# EAGLE design Gatekeeper v0.1 (EAGLE 7.1.0)
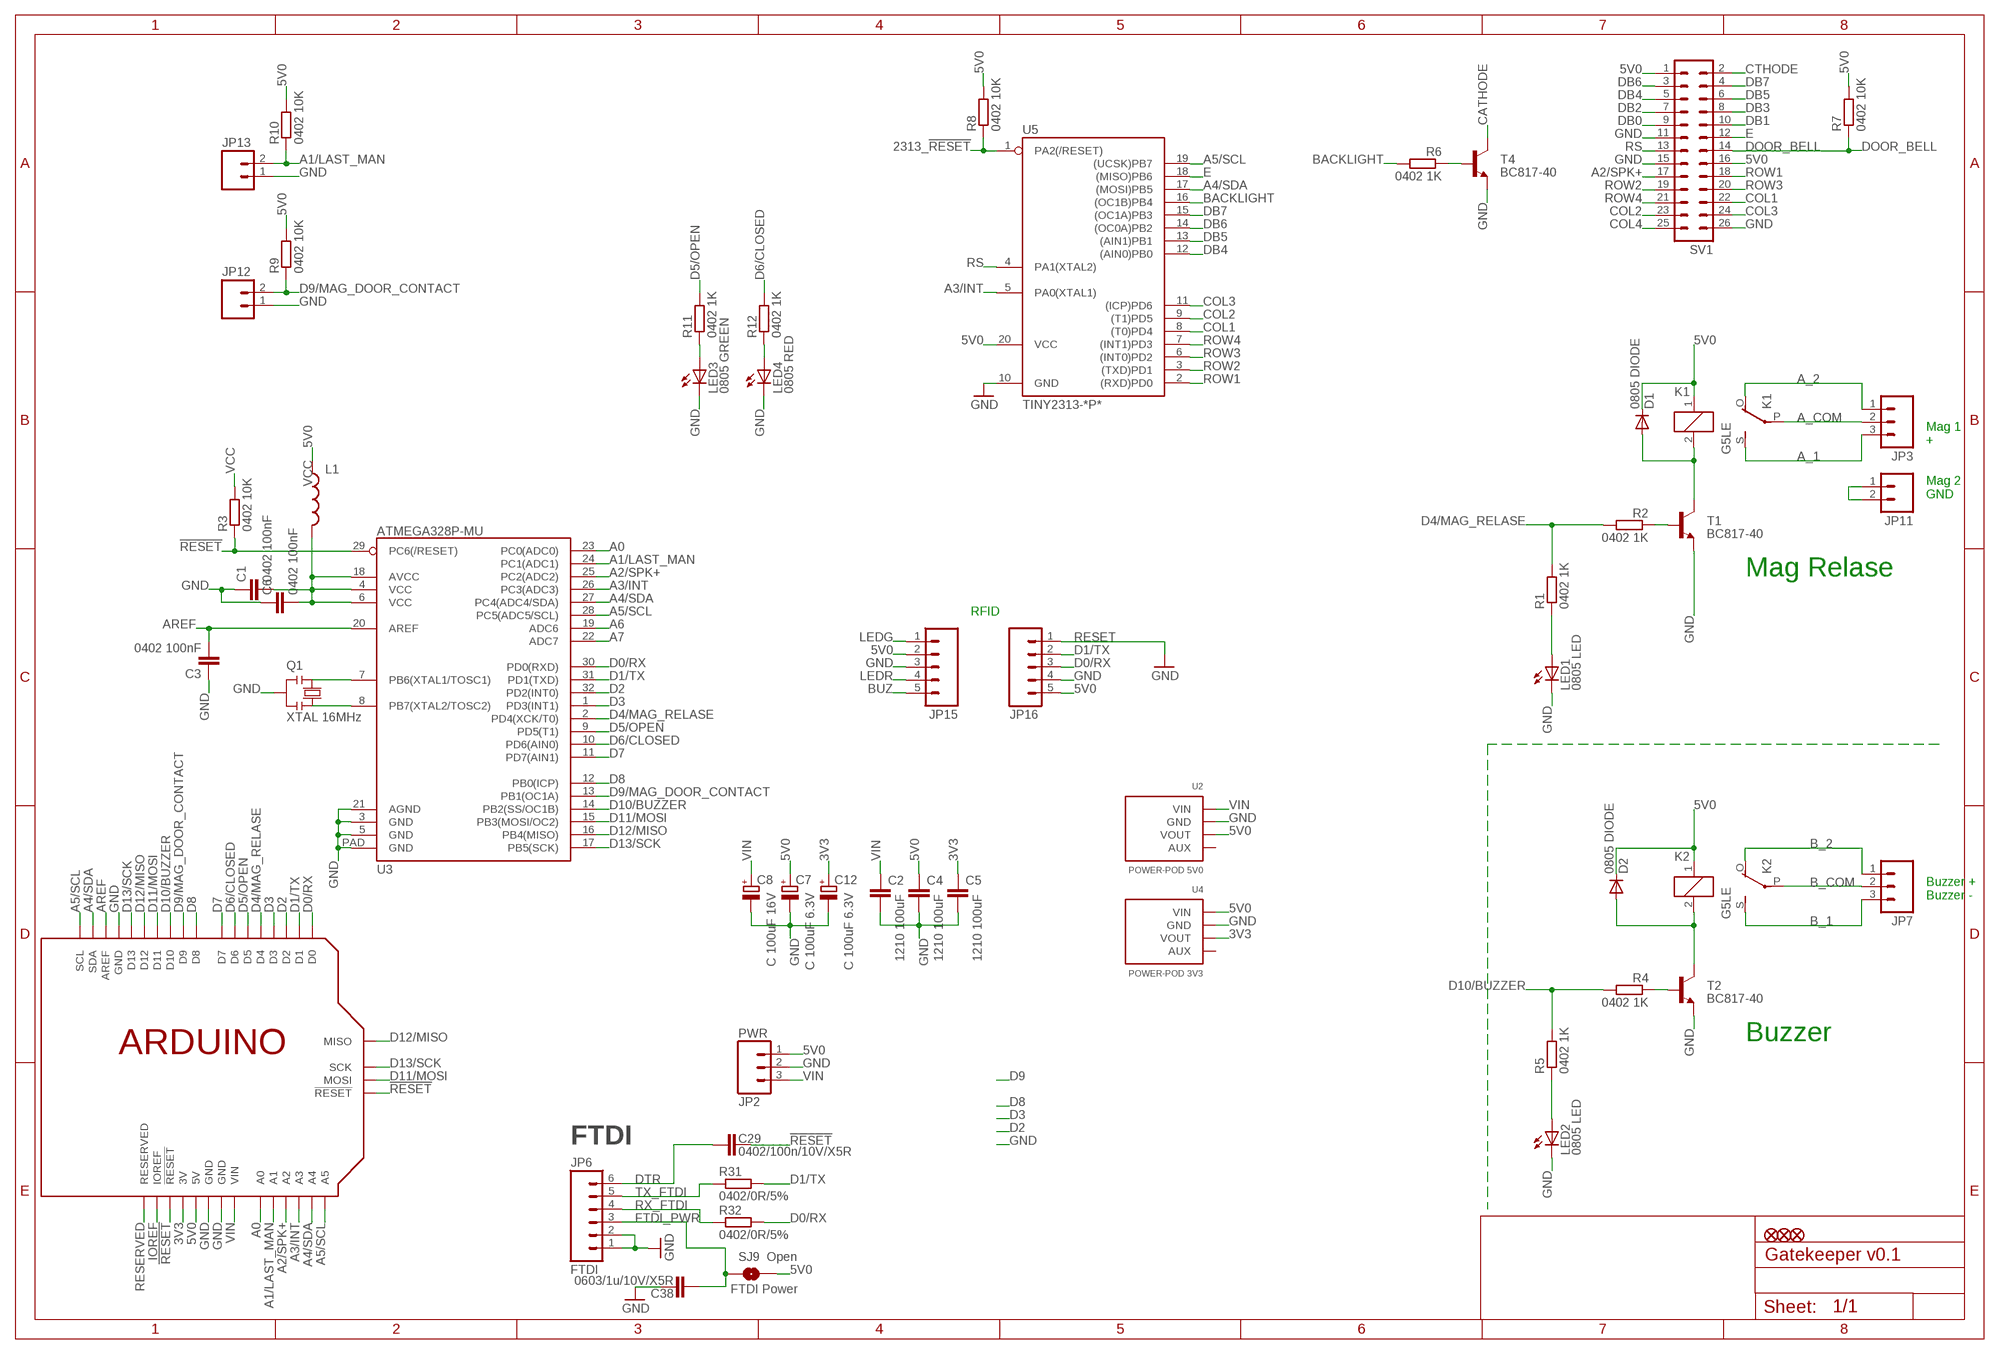
[diagram p0: schematic, sheet 1]

## Parts
C1  0402 100nF  C-EUC0402-SMALLER  [C0402-SMALLER]
C2  1210 100uF  C-EUC1210  [C1210]
C3  0402 100nF  C-EUC0402-SMALLER  [C0402-SMALLER]
C4  1210 100uF  C-EUC1210  [C1210]
C5  1210 100uF  C-EUC1210  [C1210]
C6  0402 100nF  C-EUC0402-SMALLER  [C0402-SMALLER]
C7  C 100uF 6.3V  CPOL-EUC  [PANASONIC_C]
C8  C 100uF 16V  CPOL-EUC  [PANASONIC_C]
C12  C 100uF 6.3V  CPOL-EUC  [PANASONIC_C]
C29  0402/100n/10V/X5R  C-EUC0402-ARDUINO-ROUND  [C0402-ARDUINO-ROUND]
C38  0603/1u/10V/X5R  C-EUC0603-ROUND  [C0603-ROUND]
D1  0805 DIODE  DIODE-0805  [0805-DIODE]
D2  0805 DIODE  DIODE-0805  [0805-DIODE]
JP2  PWR  M03-SCREW-5MM  [SCREWTERMINAL-5MM-3]
JP3  M03-SCREW-5MM  [SCREWTERMINAL-5MM-3]
JP6  FTDI  M06SIP  [1X06]
JP7  M03-SCREW-5MM  [SCREWTERMINAL-5MM-3]
JP8  FIDUCIAL1X2.5-STOP  [FIDUCIAL-1X2.5-STOP]
JP9  FIDUCIAL1X2.5-STOP  [FIDUCIAL-1X2.5-STOP]
JP10  FIDUCIAL1X2.5-STOP  [FIDUCIAL-1X2.5-STOP]
JP11  M025MM  [SCREWTERMINAL-5MM-2]
JP12  M025MM  [SCREWTERMINAL-5MM-2]
JP13  M025MM  [SCREWTERMINAL-5MM-2]
JP15  M05PTH  [1X05]
JP16  M05PTH  [1X05]
K1  G5LE  [G5LE]
K2  G5LE  [G5LE]
L1  INDUCTOR0603K-SMALL  [C0603K-SMALL]
LED1  0805 LED  LED0805-1206  [LED-0805-1206]
LED2  0805 LED  LED0805-1206  [LED-0805-1206]
LED3  0805 GREEN  LED0805-1206  [LED-0805-1206]
LED4  0805 RED  LED0805-1206  [LED-0805-1206]
Q1  XTAL 16MHz  RESONATORMU  [RESONATOR]
R1  0402 1K  R-EU_R0402-SMALLER  [R0402-SMALLER]
R2  0402 1K  R-EU_R0402-SMALLER  [R0402-SMALLER]
R3  0402 10K  R-EU_R0402-SMALLER  [R0402-SMALLER]
R4  0402 1K  R-EU_R0402-SMALLER  [R0402-SMALLER]
R5  0402 1K  R-EU_R0402-SMALLER  [R0402-SMALLER]
R6  0402 1K  R-EU_R0402-SMALLER  [R0402-SMALLER]
R7  0402 10K  R-EU_R0402-SMALLER  [R0402-SMALLER]
R8  0402 10K  R-EU_R0402-SMALLER  [R0402-SMALLER]
R9  0402 10K  R-EU_R0402-SMALLER  [R0402-SMALLER]
R10  0402 10K  R-EU_R0402-SMALLER  [R0402-SMALLER]
R11  0402 1K  R-EU_R0402-SMALLER  [R0402-SMALLER]
R12  0402 1K  R-EU_R0402-SMALLER  [R0402-SMALLER]
R31  0402/0R/5%  R-EU_R0402-ARDUINO-ROUND  [R0402-ARDUINO-ROUND]
R32  0402/0R/5%  R-EU_R0402-ARDUINO-ROUND  [R0402-ARDUINO-ROUND]
SJ9  FTDI Power  SOLDERJUMPERNO  [SJ_2S-NO]
SV1  MA13-2  [MA13-2]
T1  BC817-40  BC817-NPN-SOT23-BEC  [SOT23-BEC]
T2  BC817-40  BC817-NPN-SOT23-BEC  [SOT23-BEC]
T4  BC817-40  BC817-NPN-SOT23-BEC  [SOT23-BEC]
U1  ARDUINOSPI-REFRENCE  [ARDUINOR3-LWKTXT-REF-SPI]
U2  POWER-POD 5V0  POWER-POD  [POWER-POD-LANDING]
U3  ATMEGA328P-MU  ATMEGA328-MLF-SHORT  [MLF32-SHORT-CREAM]
U4  POWER-POD 3V3  POWER-POD  [POWER-POD-LANDING]
U5  TINY2313-*P*  [DIL20]

## Nets
3V3: C5.1 C12.+ U1.3V U4.3(VOUT)
5V0: C4.1 C7.+ D1.C D2.C JP2.1 JP15.2 JP16.5 K1.1 K2.1 L1.1 R7.2 R8.2 R9.2 R10.2 SJ9.2 SV1.1 SV1.16 U1.5V U1.5V@ISP(5V) U2.3(VOUT) U4.1(VIN) U5.20(VCC)
2313_!RESET: R8.1 U5.1(PA2(/RESET))
!RESET: C29.1 R3.1 U1.!RESET U1.!RESET@ISP(!RESET) U3.29(PC6(/RESET))
A0: U1.A0 U3.23(PC0(ADC0))
A1/LAST_MAN: JP13.2 R10.1 U1.A1 U3.24(PC1(ADC1))
A2/SPK+: SV1.17 U1.A2 U3.25(PC2(ADC2))
A3/INT: U1.A3 U3.26(PC3(ADC3)) U5.5(PA0(XTAL1))
A4/SDA: U1.A4 U1.SDA U3.27(PC4(ADC4/SDA)) U5.17((MOSI)PB5)
A5/SCL: U1.A5 U1.SCL U3.28(PC5(ADC5/SCL)) U5.19((UCSK)PB7)
A6: U3.19(ADC6)
A7: U3.22(ADC7)
A_1 [MAINS]: JP3.3 K1.S(2:S)
A_2 [MAINS]: JP3.1 K1.O(2:O)
A_COM [MAINS]: JP3.2 K1.P(2:P)
AREF: C3.2 U1.AREF U3.20(AREF)
B_1 [MAINS]: JP7.3 K2.S(2:S)
B_2 [MAINS]: JP7.1 K2.O(2:O)
B_COM [MAINS]: JP7.2 K2.P(2:P)
BACKLIGHT: R6.2 U5.16((OC1B)PB4)
BUZ: JP15.5
CATHODE: T4.C
COL1: SV1.22 U5.8((T0)PD4)
COL2: SV1.23 U5.9((T1)PD5)
COL3: SV1.24 U5.11((ICP)PD6)
COL4: SV1.25
CTHODE: SV1.2
D0/RX: JP16.3 R32.2 U1.D0 U3.30(PD0(RXD))
D1/TX: JP16.2 R31.2 U1.D1 U3.31(PD1(TXD))
D2: U1.D2 U3.32(PD2(INT0))
D3: U1.D3 U3.1(PD3(INT1))
D4/MAG_RELASE: R1.2 R2.2 U1.D4 U3.2(PD4(XCK/T0))
D5/OPEN: R11.2 U1.D5 U3.9(PD5(T1))
D6/CLOSED: R12.2 U1.D6 U3.10(PD6(AIN0))
D7: U1.D7 U3.11(PD7(AIN1))
D8: U1.D8 U3.12(PB0(ICP))
D9/MAG_DOOR_CONTACT: JP12.2 R9.1 U1.D9 U3.13(PB1(OC1A))
D10/BUZZER: R4.2 R5.2 U1.D10 U3.14(PB2(SS/OC1B))
D11/MOSI: U1.D11 U1.MOSI U3.15(PB3(MOSI/OC2))
D12/MISO: U1.D12 U1.MISO U3.16(PB4(MISO))
D13/SCK: U1.D13 U1.SCK U3.17(PB5(SCK))
DB0: SV1.9
DB1: SV1.10
DB2: SV1.7
DB3: SV1.8
DB4: SV1.5 U5.12((AIN0)PB0)
DB5: SV1.6 U5.13((AIN1)PB1)
DB6: SV1.3 U5.14((OC0A)PB2)
DB7: SV1.4 U5.15((OC1A)PB3)
DOOR_BELL: R7.1 SV1.14
DTR: C29.2 JP6.6
E: SV1.12 U5.18((MISO)PB6)
FTDI_PWR: C38.2 JP6.3 SJ9.1
GND: C1.1 C2.2 C3.1 C4.2 C5.2 C6.1 C7.- C8.- C12.- C38.1 JP2.2 JP6.1 JP6.2 JP12.1 JP13.1 JP15.3 JP16.4 LED1.C LED2.C LED3.C LED4.C Q1.2 SV1.11 SV1.15 SV1.26 T1.E T2.E T4.E U1.GND@1(GND) U1.GND@2(GND) U1.GND@3(GND) U1.GND@ISP(GND) U2.2(GND) U3.3(GND) U3.5(GND) U3.21(AGND) U3.PAD(GND) U4.2(GND) U5.10(GND)
IOREF: U1.IOREF
LED2_RELAY: LED1.A R1.1
LED_RELAYB: LED2.A R5.1
LEDG: JP15.1
LEDR: JP15.4
N$1: R4.1 T2.B
N$3: Q1.1 U3.7(PB6(XTAL1/TOSC1))
N$4: Q1.3 U3.8(PB7(XTAL2/TOSC2))
N$5: JP11.1 JP11.2
N$6: R2.1 T1.B
N$7: R6.1 T4.B
N$11: LED3.A R11.1
N$12: LED4.A R12.1
RESERVED: U1.RESERVED
RESET: JP16.1 ; supply symbol labelled GND
ROW1: SV1.18 U5.2((RXD)PD0)
ROW2: SV1.19 U5.3((TXD)PD1)
ROW3: SV1.20 U5.6((INT0)PD2)
ROW4: SV1.21 U5.7((INT1)PD3)
RS: SV1.13 U5.4(PA1(XTAL2))
RX_FTDI: JP6.4 R32.1
TO-TR: D1.A K1.2 T1.C
TO-TR1: D2.A K2.2 T2.C
TX_FTDI: JP6.5 R31.1
VCC: C1.2 C6.2 L1.2 R3.2 U3.4(VCC) U3.6(VCC) U3.18(AVCC)
VIN: C2.1 C8.+ JP2.3 U1.VIN U2.1(VIN)
Unconnected: U2.4(AUX) U4.4(AUX)

## Notes on the sheet
- Mag 1
  +
  
  
  Mag 2
  GND
- Mag Relase
- RFID
- Buzzer +
  Buzzer -
- Buzzer
- FTDI
- Open

## Library data of the parts
C1-C6 = CISECO eaglecad designs:C-EU: CAPACITOR, European symbol
C7 C8 C12 = rcl:CPOL-EU: POLARIZED CAPACITOR, European symbol
C29 C38 = TiLDA Mk2 Parts:C-EU: CAPACITOR, European symbol
D1 D2 = CISECO eaglecad designs:DIODE-: DIODE
JP2 JP3 JP7 = CISECO eaglecad designs:M03: Header 3 Standard 3-pin 0.1" header. Use with straight break away headers (SKU : PRT-00116), right angle break away headers (PRT-00553), swiss pins (PRT-00743), machine pins (PRT-00117), and female headers (PRT-00115). Molex polarized connector foot print use with SKU : PRT-08232 with associated crimp pins and housings.
JP6 = TiLDA Mk2 Parts:M06: Header 6 Standard 6-pin 0.1" header. Use with straight break away headers (SKU : PRT-00116), right angle break away headers (PRT-00553), swiss pins (PRT-00743), machine pins (PRT-00117), and female headers (PRT-00115). Molex polarized connector foot print use with SKU : PRT-08094 with associated crimp pins and housings. NOTES ON THE VARIANTS LOCK and LOCK_LONGPADS... This footprint was designed to help hold the alignment of a through-hole component (i.e. 6-pin header) while soldering it into place. You may notice that each hole has been shifted either up or down by 0.005 of an inch from it's more standard position (which is a perfectly straight line). This slight alteration caused the pins (the squares in the middle) to touch the edges of the holes. Because they are alternating, it causes a "brace" to hold the component in place. 0.005 has proven to be the perfect amount of "off-center" position when using our standard breakaway headers. Although looks a little odd when you look at the bare footprint, once you have a header in there, the alteration is very hard to notice. Also, if you push a header all the way into place, it is covered up entirely on the bottom side. This idea of altering the position of holes to aid alignment will be further integrated into the Sparkfun Library for other footprints. It can help hold any component with 3 or more connection pins.
JP8-JP10 = CISECO eaglecad designs:FIDUCIAL: Fiducial Alignment Points Various fiducial points for machine vision alignment.
JP11-JP13 = CISECO eaglecad designs:M02: Header 2 Standard 2-pin 0.1" header. Use with straight break away headers (SKU : PRT-00116), right angle break away headers (PRT-00553), swiss pins (PRT-00743), machine pins (PRT-00117), and female headers (PRT-00115). Molex polarized connector foot print use with SKU : PRT-08233 with associated crimp pins and housings.
JP15 JP16 = SparkFun:M05: Header 5 Standard 5-pin 0.1" header. Use with straight break away headers (SKU : PRT-00116), right angle break away headers (PRT-00553), swiss pins (PRT-00743), machine pins (PRT-00117), and female headers (PRT-00115). Molex polarized connector foot print use with SKU : PRT-08230 with associated crimp pins and housings.
K1 K2 = relay:G5LE: RELAY 1 x switch, 10 A/120 V AC, 8 A/30 V DC, Omron; OC_FARNELL: unknown; OC_NEWARK: unknown
L1 = CISECO eaglecad designs:INDUCTOR: Inductors Basic Inductor/Choke - 0603 and 1206. Footprints are not proven and vary greatly between part numbers.
LED1-LED4 = CISECO eaglecad designs:LED: LEDs Standard schematic elements and footprints for 5mm, 3mm, 1206, and 0603 sized LEDs. 5mm - Spark Fun Electronics SKU : COM-00529 (and others)
Q1 = MySMD2:RESONATOR
R1-R12 = CISECO eaglecad designs:R-EU_: RESISTOR, European symbol
R31 R32 = TiLDA Mk2 Parts:R-EU_: RESISTOR, European symbol
SJ9 = TiLDA Mk2 Parts:SOLDERJUMPER: Solder Jumper Standard SMD solder jumper. Used to automate production. Two varients : Normally Open and Normally Closed are the same, but have different paste layers. NC will have a large amount of paste and should jumper during reflow.
SV1 = CISECO eaglecad designs:MA13-2: PIN HEADER; OC_FARNELL: unknown; OC_NEWARK: unknown
T1 T2 T4 = transistor:*-NPN-: NPN Transistror BF959 corrected 2008.03.06
U1 = CISECO eaglecad designs:ARDUINOSPI
U2 U4 = Ciseco Footprints:POWER-POD
U3 = CISECO eaglecad designs:ATMEGA328-MLF
U5 = avr-6:TINY2313*: Atmel Tiny2313 2K Flash, 128 bytes EEPROM, 128 bytes RAM

## Net classes
2 MAINS: clearance 2 mm

## Board
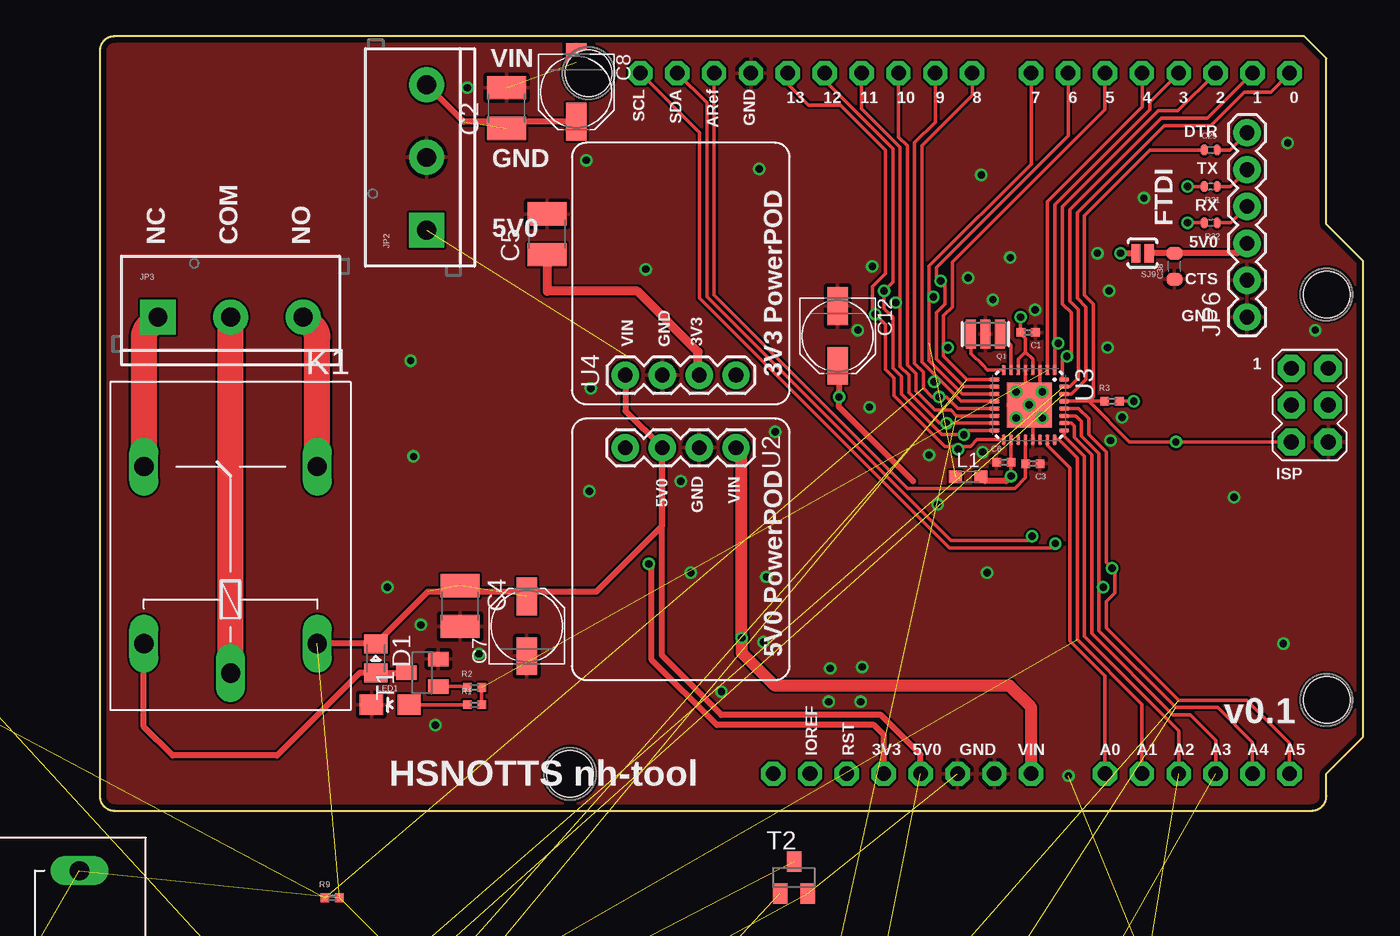
[diagram p1: board, top side]
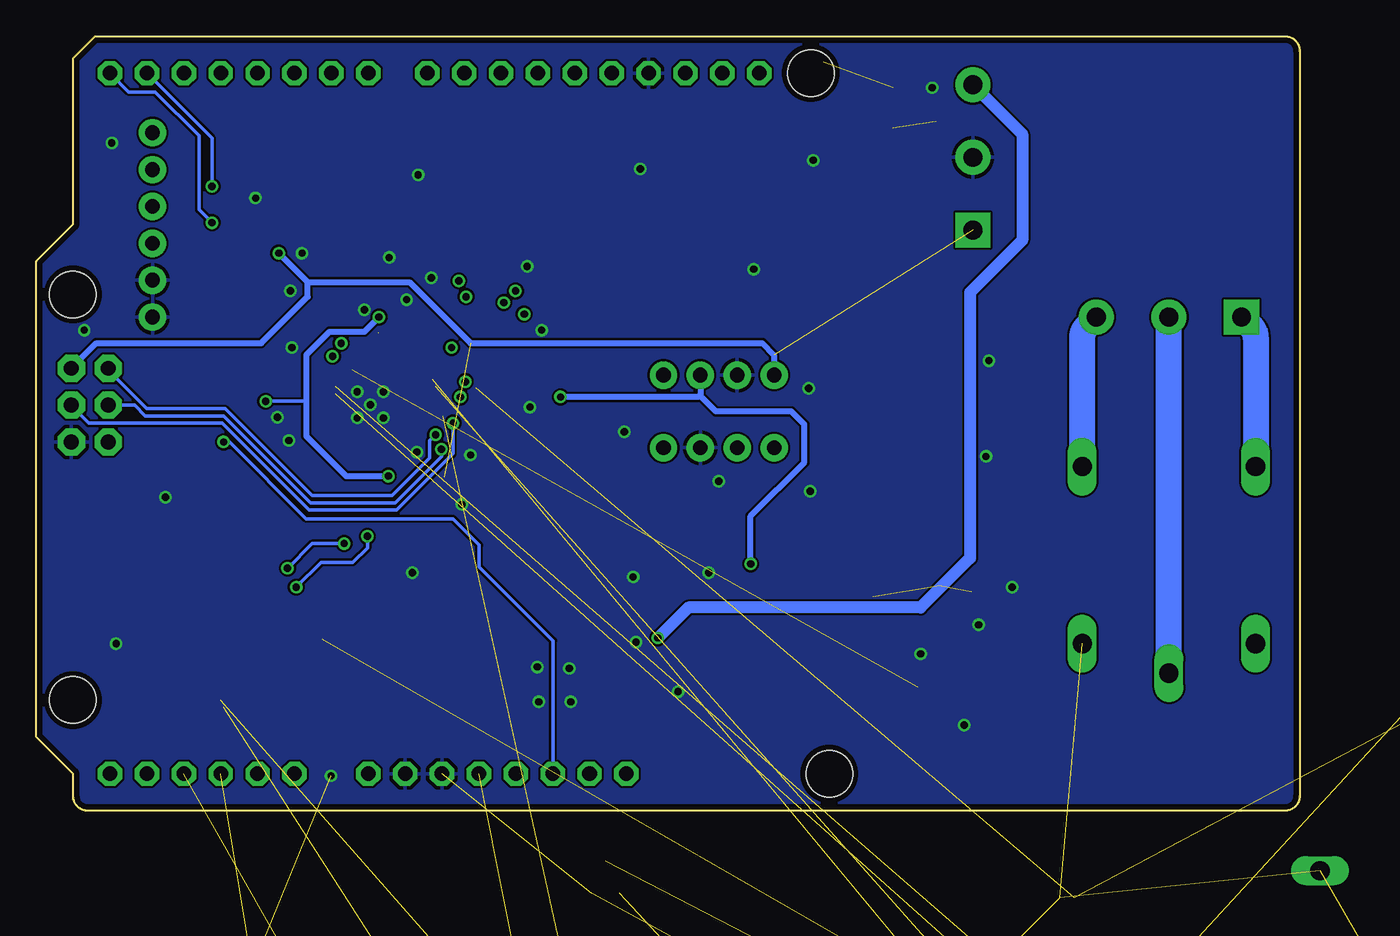
[diagram p2: board, bottom side, seen from below]

Size 87 x 53.34 mm. Coordinates in mm from the lower left corner, seen from the top.
Outline: 0,52.34 0,1 arc90 1,0 83.46,0 arc90 84.46,1 84.46,2.54 87,5.08 87,37.85 84.46,40.39 84.46,51.82 82.94,53.34 1,53.34 arc90 0,52.34
Copper layers (1*16): Top 0.0356mm / dielectric 1.5011mm / Bottom 0.0356mm
Design rules "default *": minimum track width 6mil, minimum drill 13mil, track to track 6mil, track to pad 6mil, pad to pad 6mil, via to via 6mil, smd to smd 6mil, copper to edge 15mil, drill to drill 6mil, minimum pad ring 7mil, minimum via ring 7mil, stop-mask expansion 3mil, vias tented up to drill 23mil, thermal gap 10mil
Holes 3.2 mm at 84.48,35.56 84.48,7.62 32.39,2.54 33.66,50.8

### Footprints (pad centres in the part's own frame; a part is rotated, then mirrored left to right if it is on the bottom)
C0402-SMALLER = smd 0.6 x 0.6: 1 -0.5,0; 2 0.5,0
C1210 = smd 1.6 x 2.7: 1 -1.4,0; 2 1.4,0
PANASONIC_C = smd 2.6 x 1.4: + 2.05,0; - -2.05,0
C0402-ARDUINO-ROUND = smd 0.508 x 0.762: 1 -0.445,0; 2 0.445,0
C0603-ROUND = smd 0.898 x 1.1: 1 -0.889,0; 2 0.889,0
0805-DIODE = smd 1.3 x 1.6: A 1,0; C -1,0
SCREWTERMINAL-5MM-3 = drill 1.3 pad 2.413 square: 1 0,0 | drill 1.3 pad 2.413: 2 5,0; 3 10,0
1X06 = drill 1.016 pad 1.88: 1 0,0; 2 2.54,0; 3 5.08,0; 4 7.62,0; 5 10.16,0; 6 12.7,0
FIDUCIAL-1X2.5-STOP = smd 1 x 1: 1 0,0
SCREWTERMINAL-5MM-2 = drill 1.3 pad 2.032 square: 1 0,0 | drill 1.3 pad 2.032: 2 5,0
1X05 = drill 1.016 pad 1.88: 1 0,0; 2 2.54,0; 3 5.08,0; 4 7.62,0; 5 10.16,0
G5LE = drill 1.321 long: 1 -7.493,-5.969; 2 -7.493,5.969; O 4.699,5.969; P -9.525,0; S 4.699,-5.969
C0603K-SMALL = smd 0.889 x 0.889: 1 -0.875,0; 2 0.875,0
LED-0805-1206 = smd 1.6 x 1.4: A 1.3,0; C -1.3,0
RESONATOR = smd 0.7 x 2: 1 -1,0; 2 0,0; 3 1,0
R0402-SMALLER = smd 0.6 x 0.6: 1 -0.5,0; 2 0.5,0
R0402-ARDUINO-ROUND = smd 0.508 x 0.762: 1 -0.445,0; 2 0.445,0
SJ_2S-NO = smd 0.635 x 1.27: 1 -0.45,0; 2 0.45,0
MA13-2 = drill 1.016 octagon: 1 -15.24,-1.27; 2 -15.24,1.27; 3 -12.7,-1.27; 4 -12.7,1.27; 5 -10.16,-1.27; 6 -10.16,1.27; 7 -7.62,-1.27; 8 -7.62,1.27; 9 -5.08,-1.27; 10 -5.08,1.27; 11 -2.54,-1.27; 12 -2.54,1.27; 13 0,-1.27; 14 0,1.27; 15 2.54,-1.27; 16 2.54,1.27; 17 5.08,-1.27; 18 5.08,1.27; 19 7.62,-1.27; 20 7.62,1.27; 21 10.16,-1.27; 22 10.16,1.27; 23 12.7,-1.27; 24 12.7,1.27; 25 15.24,-1.27; 26 15.24,1.27
SOT23-BEC = smd 1 x 1.4: B -0.95,-1.1; C 0,1.1; E 0.95,-1.1
ARDUINOR3-LWKTXT-REF-SPI = drill 1 pad 1.676 octagon: 3V 35.56,2.54; 5V 38.1,2.54; !RESET 33.02,2.54; A0 50.8,2.54; A1 53.34,2.54; A2 55.88,2.54; A3 58.42,2.54; A4 60.96,2.54; A5 63.5,2.54; AREF 23.876,50.8; D0 63.5,50.8; D1 60.96,50.8; D2 58.42,50.8; D3 55.88,50.8; D4 53.34,50.8; D5 50.8,50.8; D6 48.26,50.8; D7 45.72,50.8; D8 41.656,50.8; D9 39.116,50.8; D10 36.576,50.8; D11 34.036,50.8; D12 31.496,50.8; D13 28.956,50.8; GND@1 43.18,2.54; GND@2 40.64,2.54; GND@3 26.416,50.8; IOREF 30.48,2.54; RESERVED 27.94,2.54; SCL 18.796,50.8; SDA 21.336,50.8; VIN 45.72,2.54 | drill 1.016 pad 1.88 octagon: 5V@ISP 66.167,30.48; !RESET@ISP 63.627,25.4; GND@ISP 66.167,25.4; MISO 63.627,30.48; MOSI 66.167,27.94; SCK 63.627,27.94
POWER-POD-LANDING = drill 1.016 pad 1.88: 1 -3.81,0; 2 -1.27,0; 3 1.27,0; 4 3.81,0
MLF32-SHORT-CREAM = smd 0.7 x 0.28: 1 -2.4,1.75; 2 -2.4,1.25; 3 -2.4,0.75; 4 -2.4,0.25; 5 -2.4,-0.25; 6 -2.4,-0.75; 7 -2.4,-1.25; 8 -2.4,-1.75; 17 2.4,-1.75; 18 2.4,-1.25; 19 2.4,-0.75; 20 2.4,-0.25; 21 2.4,0.25; 22 2.4,0.75; 23 2.4,1.25; 24 2.4,1.75 | smd 0.28 x 0.7: 9 -1.75,-2.4; 10 -1.25,-2.4; 11 -0.75,-2.4; 12 -0.25,-2.4; 13 0.25,-2.4; 14 0.75,-2.4; 15 1.25,-2.4; 16 1.75,-2.4; 25 1.75,2.4; 26 1.25,2.4; 27 0.75,2.4; 28 0.25,2.4; 29 -0.25,2.4; 30 -0.75,2.4; 31 -1.25,2.4; 32 -1.75,2.4 | smd 3.1 x 3.1: PAD 0,0
DIL20 = drill 0.813 long: 1 -11.43,-3.81; 2 -8.89,-3.81; 3 -6.35,-3.81; 4 -3.81,-3.81; 5 -1.27,-3.81; 6 1.27,-3.81; 7 3.81,-3.81; 8 6.35,-3.81; 9 8.89,-3.81; 10 11.43,-3.81; 11 11.43,3.81; 12 8.89,3.81; 13 6.35,3.81; 14 3.81,3.81; 15 1.27,3.81; 16 -1.27,3.81; 17 -3.81,3.81; 18 -6.35,3.81; 19 -8.89,3.81; 20 -11.43,3.81

### Placement (x,y rotation side)
C1  63.93,32.94 180 top
C2  28,48.4 90 top
C3  64.25,23.9 180 top
C4  24.8,14.1 270 top
C5  30.8,39.7 90 top
C6  62.25,24 0 top
C7  29.4,12.7 90 top
C8  32.8,49.5 270 top
C12  50.8,32.7 270 top
C29  76.5,45.5 0 top
C38  74,37.5 90 top
D1  19,10.5 270 top
D2  31.1,-11.6 0 top  (outside the outline)
JP2  22.5,40 90 top
JP3  4,34 0 top
JP6  79,34 90 top
JP7  -24,-15 90 top  (outside the outline)
JP8  30.5,-19.4 0 top  (outside the outline)
JP9  30.5,-22.5 0 top  (outside the outline)
JP10  30.5,-25.6 0 top  (outside the outline)
JP11  -24,0 90 top  (outside the outline)
JP12  -24,10 90 top  (outside the outline)
JP13  -24,20 90 top  (outside the outline)
JP15  -16,-25 0 top  (outside the outline)
JP16  -16,-40.24 0 top  (outside the outline)
K1  9,19 90 top
K2  -8.9,-10.1 180 top  (outside the outline)
L1  59.8,23 0 top
LED1  20,7.3 0 top
LED2  31.1,-16 0 top  (outside the outline)
LED3  17,-22 0 top  (outside the outline)
LED4  17,-26 0 top  (outside the outline)
Q1  60.98,32.83 180 top
R1  25.8,7.3 0 top
R2  25.8,8.5 0 top
R3  69.7,28.2 0 top
R4  42.6,-10.8 0 top  (outside the outline)
R5  50.1,-10.8 0 top  (outside the outline)
R6  24,-25 0 top  (outside the outline)
R7  21,-25 0 top  (outside the outline)
R8  24,-14 0 top  (outside the outline)
R9  16,-6 0 top  (outside the outline)
R10  16,-18 0 top  (outside the outline)
R11  13,-26 0 top  (outside the outline)
R12  10,-26 0 top  (outside the outline)
R31  76.5,43 180 top
R32  76.5,40.5 180 top
SJ9  71.8,38.4 180 top
SV1  64,-28 0 top  (outside the outline)
T1  22.2,9.5 90 top
T2  47.8,-4.6 0 top  (outside the outline)
T4  25,-20 0 top  (outside the outline)
U1  18.42,0 0 top
U2  40,25 180 top
U3  64,27.95 270 top
U4  40,30 0 top
U5  64.8,-17.1 0 top  (outside the outline)

### Tracks (layer width: path | path; a pad name or v marks a point on that pad's centre or on a via)
3V3  (via drill 0.5)
  Top 0.406: U1.3V 53.98,5.22 53.3,5.9 42.5,5.9 38,10.4 38,16.8 v37.8,17 | 56,22.7 50.9,27.8 v50.9,28.5 50.9,30.65 C12.+
  Top 0.61: U4.3 41.2,30.07 41.2,31.6 37.02,35.78 30.8,35.78 C5.1
  Bottom 0.406: v37.8,17 37.8,20.3 34.1,24 34.1,26.6 35,27.5 40.2,27.5 41.3,28.6 | U4.3 41.27,28.63 41.3,28.6 | 41.3,28.6 41.4,28.5 v50.9,28.5
5V0  (via drill 0.5)  (15 unrouted)
  Top 0.254: D1.C
  Top 0.406: D1.C K1.1 | D1.C 22.6,15.1 34.2,15.1 38.73,19.63 U2.3 | U1.5V 56.52,3.88 53.8,6.6 42.8,6.6 38.7,10.7 38.7,25 U2.3 | U4.1 36.19,27.54 U2.3 | v70.3,38.4 SJ9.2
  Bottom 0.406: U1.5V@ISP 82.87,32.2 71.5,32.2 68.3,35.4 68.3,36.4 | 68.3,36.4 61.3,36.4 57.1,32.2 37,32.2 36.2,31.4 U4.1 | 68.3,36.4 v70.3,38.4
2313_!RESET  (1 unrouted)
!RESET  (via drill 0.5)
  Top 0.254: C29.1 72.3,45.5 67.8,41 67.8,35.5 68.4,34.9 68.4,28.5 68.1,28.2 | 68.1,28.2 R3.1 | 68.1,28.2 U3.29 | U1.!RESET@ISP v74.1,25.4 70.9,25.4 68.1,28.2
  Bottom 0.254: U1.!RESET 51.4,2.58 51.4,11.7 56.5,16.8 56.5,18.3 58.3,20.1 68.4,20.1 73.7,25.4 v74.1,25.4
A0
  Top 0.254: U1.A0 69.22,9.28 66.8,11.7 66.8,23.6 65.25,25.15 U3.23
A1/LAST_MAN  (2 unrouted)
  Top 0.254: U1.A1 71.76,7.34 67.3,11.8 67.3,24.3 66.05,25.55 U3.24
A2/SPK+  (1 unrouted)
  Top 0.254: U1.A2 74.3,5.5 67.8,12 67.8,24.4 66.4,25.8 U3.25
A3/INT  (1 unrouted)
  Top 0.254: U1.A3 76.84,4.86 75.1,6.6 73.9,6.6 68.3,12.2 68.3,24.5 67.1,25.7 67.1,26.5 66.9,26.7 U3.26
A4/SDA  (via drill 0.5)  (1 unrouted)
  Top 0.254: 68.8,15.4 68.8,24.6 67.6,25.8 67.6,26.8 67.2,27.2 U3.27 | 68.8,15.4 68.8,12.4 74.1,7.1 77,7.1 79.38,4.72 U1.A4 | v69.1,15.4 68.8,15.4 | U1.SDA 41.8,48.76 41.8,35.4 58.6,18.6 63.9,18.6 v64.2,18.9
  Bottom 0.254: v64.2,18.9 64.2,18.1 65.2,17.1 67.4,17.1 v69.1,15.4
A5/SCL  (via drill 0.5)  (1 unrouted)
  Top 0.254: U1.A5 81.92,4.68 79,7.6 74.3,7.6 69.3,12.6 69.3,14.4 69.9,15 69.9,16.5 v69.7,16.7 69.3,17.1 69.3,24.7 68.1,25.9 68.1,27 67.4,27.7 U3.28 | U1.SCL 41.3,46.72 41.3,35.3 58.5,18.1 65.5,18.1 v65.8,18.4
  Bottom 0.254: v65.8,18.4 68,18.4 v69.7,16.7
A_1
  Top 1.778: JP3.3 14.68,33.32 arc-45 14.97,32.62 K1.S
  Bottom 1.778: JP3.3 14.68,33.32 arc-45 14.97,32.62 K1.S
A_2
  Top 1.778: JP3.1 3.32,33.32 arc45 3.03,32.62 K1.O
  Bottom 1.778: K1.O 3.03,32.62 arc-45 3.32,33.32 JP3.1
A_COM
  Top 1.778: K1.P JP3.2
  Bottom 1.778: K1.P JP3.2
AREF
  Top 0.254: U1.AREF 42.3,35.5 55.6,22.2 63,22.2 63.75,22.95 C3.2 U3.20
B_1  (1 unrouted)
B_2  (1 unrouted)
B_COM  (1 unrouted)
BACKLIGHT  (1 unrouted)
COL1  (1 unrouted)
COL2  (1 unrouted)
COL3  (1 unrouted)
D0/RX  (via drill 0.5)  (1 unrouted)
  Top 0.254: U1.D0 80.62,49.5 78.8,49.5 76.5,47.2 73.3,47.2 67.3,41.2 67.3,35.3 67.9,34.7 67.9,29.7 66.9,28.7 U3.30 | R32.2 v74.9,40.5
  Bottom 0.254: v74.9,40.5 75.8,41.4 75.8,46.5 78.8,49.5 80.62,49.5 U1.D0
D1/TX  (via drill 0.5)  (1 unrouted)
  Top 0.254: U1.D1 76.28,47.7 73.1,47.7 66.8,41.4 66.8,35.1 67.4,34.5 67.4,29.8 66.8,29.2 U3.31 | R31.2 v74.9,43
  Bottom 0.254: v74.9,43 74.9,46.32 U1.D1
D2  (via drill 0.5)
  Top 0.254: U1.D2 74.24,48.2 72.9,48.2 66.3,41.6 66.3,34.9 66.9,34.3 66.9,31.6 v66.6,31.3 66.3,31.3 66.3,29.8 U3.32
D3  (via drill 0.5)
  Top 0.254: U3.1 65.75,32.2 | 65.75,32.2 65.75,41.75 72.3,48.3 72.3,48.8 U1.D3 | v66,32.2 65.75,32.2
D4/MAG_RELASE  (1 unrouted)
  Top 0.254: U1.D4 71.8,50.76 71.8,48.5 65.25,41.95 U3.2 | R1.2 R2.2
D5/OPEN  (via drill 0.5)  (1 unrouted)
  Top 0.254: 58.1,31.9 58.1,31.3 59.7,29.7 U3.9 | 58.1,31.9 58.1,34.1 58.7,34.7 58.7,37.8 69.2,48.3 69.2,50.78 U1.D5 | v58.4,31.9 58.1,31.9
D6/CLOSED  (via drill 0.5)  (1 unrouted)
  Top 0.254: U1.D6 66.68,46.48 57.6,37.4 57.6,36.8 v57.9,36.5 58.2,36.2 58.2,34.9 57.6,34.3 57.6,31.1 59.5,29.2 U3.10
D7  (via drill 0.5)
  Top 0.254: U3.11 59.4,28.7 57.1,31 57.1,35.4 | 57.1,35.4 57.1,37.5 64.14,44.54 U1.D7 | v57.4,35.4 57.1,35.4
D8  (via drill 0.5)
  Top 0.254: U3.12 59.3,28.2 57.7,29.8 | 57.7,29.8 56.6,30.9 56.6,45.8 60.08,49.28 U1.D8 | v57.45,29.55 57.7,29.8
D9/MAG_DOOR_CONTACT  (via drill 0.5)  (2 unrouted)
  Top 0.254: U1.D9 57.54,47.44 56.1,46 56.1,30.8 56.7,30.2 56.7,29.1 57.3,28.5 v57.8,28.5 58.3,28.5 59.1,27.7 U3.13
D10/BUZZER  (2 unrouted)
  Top 0.254: U3.14 59,27.2 58.6,27.6 57.5,27.6 56.2,28.9 56.2,30.1 55.6,30.7 55.6,45.8 55,46.4 U1.D10
D11/MOSI  (via drill 0.5)
  Top 0.254: U3.15 v58.3,26.7 57.8,26.7 55.7,28.8 55.7,30 55.1,30.6 55.1,35 | 55.1,35 55.1,45.7 52.46,48.34 U1.D11 | v54.8,35 55.1,35
  Bottom 0.254: U1.MOSI 84.59,27.89 83.4,26.7 74.2,26.7 68.2,20.7 62.2,20.7 58.3,24.6 v58.3,26.7
D12/MISO  (via drill 0.5)
  Top 0.254: U3.16 59.8,26.2 v59.5,25.9 58,25.9 55.2,28.7 55.2,29.9 54.6,30.5 54.6,34 54,34.6 v54,35.8 54.6,36.4 54.6,45.6 49.92,50.28 U1.D12
  Bottom 0.254: U1.MISO 82.05,30.35 79.4,27.7 74,27.7 68,21.7 62.5,21.7 59.9,24.3 59.9,25.5 v59.5,25.9
D13/SCK  (via drill 0.5)
  Top 0.254: U1.D13 47.38,50.02 48.8,48.6 51,48.6 54.1,45.5 54.1,37 53.2,36.1 53.2,34.4 v53.4,34.2 54.1,33.5 54.1,30.4 54.7,29.8 54.7,28.6 58.2,25.1 59.1,25.1 | U3.17 60.4,25.55 59.95,25.1 59.1,25.1 | v59.1,24.9 59.1,25.1
  Bottom 0.254: U1.SCK 80.24,27.94 79.5,27.2 74.1,27.2 68.1,21.2 62.3,21.2 59.1,24.4 v59.1,24.9
DB4  (1 unrouted)
DB5  (1 unrouted)
DB6  (1 unrouted)
DB7  (1 unrouted)
DOOR_BELL  (1 unrouted)
DTR
  Top 0.254: JP6.6 77.8,45.5 C29.2
E  (1 unrouted)
FTDI_PWR
  Top 0.406: JP6.3 78.31,38.39 C38.2 SJ9.1
GND  (via drill 0.5)  (14 unrouted)
  Top 0.254: U3.5 63.75,28.2 U3.PAD | U3.PAD 64.75,28.7 U3.3 | U3.21 64.25,27.95 U3.PAD
  other vias: 64,27.95 63.1,27.05 64.9,27.05 64.9,28.85 63.1,28.85 64.4,34.5 60.8,24.7 69.6,25.5 70.4,27.1 61.5,35.2 69.4,31.9 69.5,35.8 53,27.8 52.2,33.1 53.2,37.5 37.6,37.3 33.8,29.1 40,22.7 33.7,22 40.7,16.4 45.9,16.1 42.8,8.2 50.3,9.8 45.7,11.6 52.5,9.9 50.2,7.5 52.4,7.5 66.7,2.4 61.1,16.4 57.7,21.1 57.1,24.5 46.5,26.1 45.4,44.2 60.7,43.8 62.7,38.1 71.9,42.2 81.8,46 83.7,33.1 78.1,21.6 81.5,11.5 26.1,10.8 23.1,5.9 22.1,12.8 19.8,15.4 25.3,49.8 33.5,44.8 21.6,24.4 21.4,31 59.8,36.7 68.7,38.4
  pour Bottom: 0,52.34 0,1 arc90 1,0 83.46,0 arc90 84.46,1 84.46,2.54 87,5.1 87,37.85 84.46,40.39 84.46,51.82 82.94,53.34 1,53.34 arc90
  pour Top: 0,52.34 0,1 arc90 1,0 83.46,0 arc90 84.46,1 84.46,2.54 87,5.1 87,37.85 84.46,40.39 84.46,51.82 82.94,53.34 1,53.34 arc90
LED2_RELAY
  Top 0.254: LED1.A R1.1
LED_RELAYB  (1 unrouted)
N$1  (1 unrouted)
N$3
  Top 0.254: Q1.1 62.75,32.06 U3.7
N$4
  Top 0.254: Q1.3 60,32.81 60,31.5 60.8,30.7 61.13,30.37 61.15,30.35 U3.8
N$5  (1 unrouted)
N$6
  Top 0.254: R2.1 24.88,8.55 T1.B
N$7  (1 unrouted)
N$11  (1 unrouted)
N$12  (1 unrouted)
ROW1  (1 unrouted)
ROW2  (1 unrouted)
ROW3  (1 unrouted)
ROW4  (1 unrouted)
RS  (1 unrouted)
RX_FTDI
  Top 0.254: JP6.4 77.88,40.5 R32.1
TO-TR
  Top 0.406: K1.2 3.03,5.77 5,3.8 12.2,3.8 17.9,9.5 D1.A T1.C
TO-TR1  (2 unrouted)
TX_FTDI
  Top 0.254: JP6.5 77.84,43 R31.1
VCC  (via drill 0.5)  (1 unrouted)
  Top 0.254: U3.18 C6.2 v62.75,23.05 | C1.2 63.47,32.9 63.5,32.9 | 63.75,31.6 64.25,31.1 U3.4 | 63.75,31.6 63.25,31.1 U3.6 | 63.75,31.6 63.75,32.52 63.4,32.87 | 63.4,32.87 63.43,32.9 | 63.4,32.87 v63.4,34 | R3.2 v71.2,28.2
  Top 0.406: v62.75,23.05 62.4,22.7 60.98,22.7 L1.2
  Bottom 0.254: v71.2,28.2 68.4,28.2
  Bottom 0.406: v63.4,34 64.4,33 66.8,33 68.4,31.4 68.4,28.2 68.4,25.8 65.65,23.05 v62.75,23.05
VIN  (via drill 0.5)  (1 unrouted)
  Top 0.406: C8.+ 25.05,47.45 JP2.3
  Top 0.813: U1.VIN 64.14,7.1 62.64,8.6 46.5,8.6 44.2,10.9 v44.2,11.9 44.2,24.61 U2.1
  Bottom 0.813: JP2.3 19.1,46.6 19.1,39.3 22.7,35.7 22.7,17.4 26.1,14 42.1,14 v44.2,11.9

### Text on the board
tPlace: VIN | DTR | TX | GND | RX | 5V0 | FTDI | 5V0 | NC | COM | NO | CTS | GND | 3V3 | 1 | 3V3 PowerPOD | 5V0 | ISP | 5V0 PowerPOD | v0.1 | HSNOTTS nh-tool